# EAGLE design sfm3300 adapter (EAGLE 7.3.0)
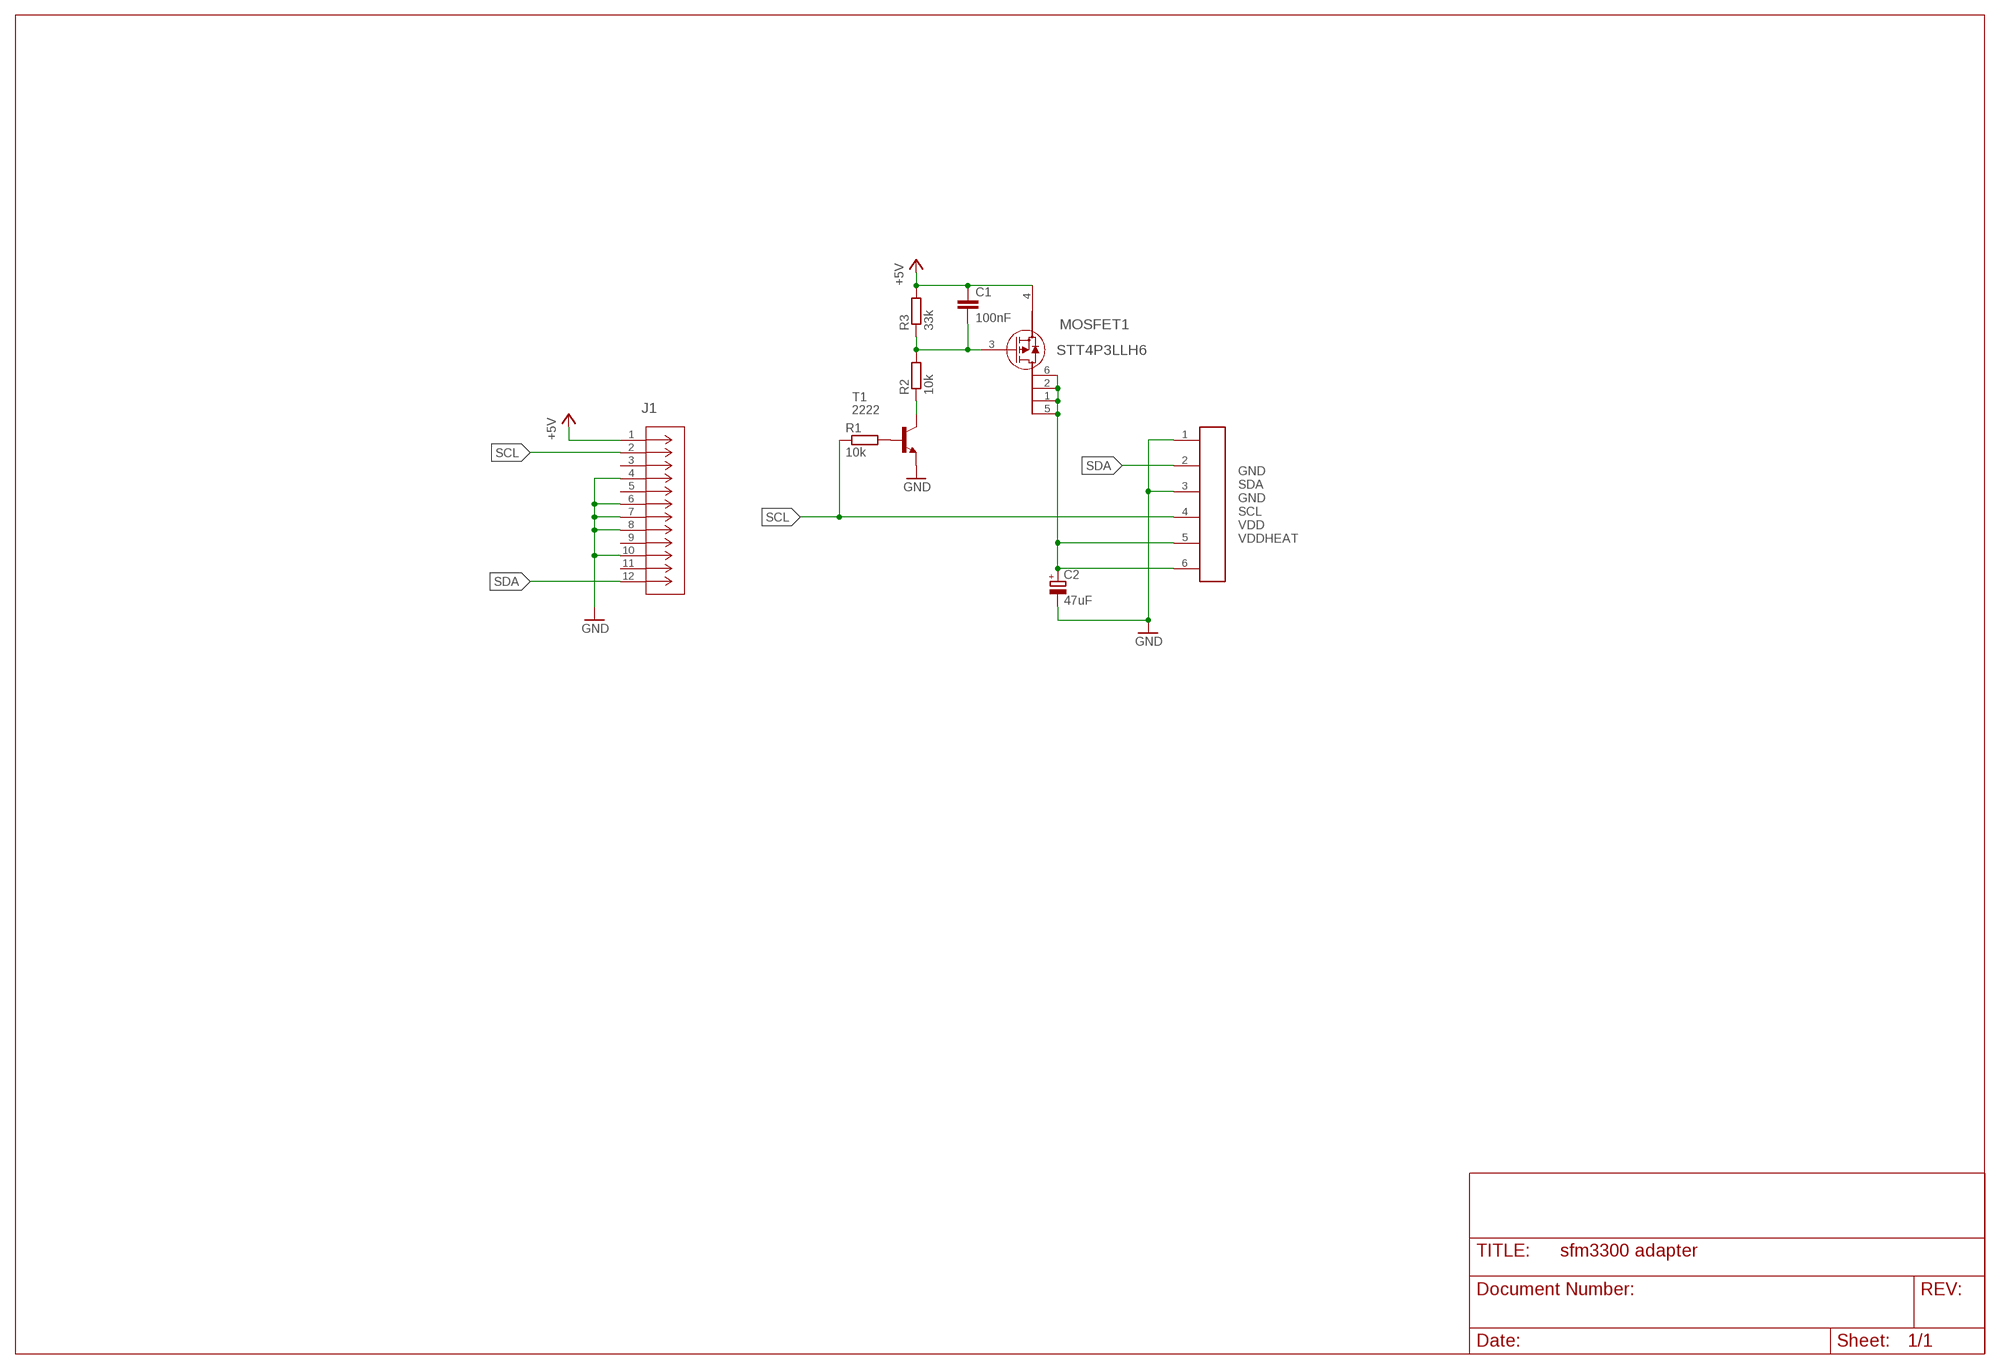
[diagram p0: schematic, sheet 1]

## Parts
C1  100nF  C-EUC0603  [C0603]
C2  47uF  CPOL-EUSMCA  [SMC_A]
J1  1-188275-2  [CONN_1-188275-2_TYC]
MOSFET1  STT4P3LLH6  [SOT23-6L_STM]
R1  10k  R-EU_R0603  [R0603]
R2  10k  R-EU_R0603  [R0603]
R3  33k  R-EU_R0603  [R0603]
T1  2222  MMBT2222ALT1-NPN-SOT23-BEC  [SOT23-BEC]
U$1  SPRING6  [SPRING-6]

## Nets
+5V: C1.1 J1.1 MOSFET1.4 R3.2
GND: C2.- J1.4 J1.6 J1.7 J1.8 J1.10 T1.E U$1.1 U$1.3
N$1: R1.2 T1.B
N$3: C1.2 MOSFET1.3 R2.2 R3.1
N$4: R2.1 T1.C
N$6: C2.+ MOSFET1.1 MOSFET1.2 MOSFET1.5 MOSFET1.6 U$1.5 U$1.6
SCL: J1.2 R1.1 U$1.4
SDA: J1.12 U$1.2
Unconnected: J1.3 J1.5 J1.9 J1.11

## Notes on the sheet
- GND
  SDA
  GND
  SCL
  VDD
  VDDHEAT

## Library data of the parts
C1 = rcl:C-EU: CAPACITOR, European symbol
C2 = rcl:CPOL-EU: POLARIZED CAPACITOR, European symbol
J1 = MICRO-MATCH SMD FTE 1-188275-2:1-188275-2; BUILT_BY: EMA_UL_Team; COPYRIGHT: Copyright (C) 2016 Accelerated Designs. All rights reserved; MANUFACTURER_PART_NUMBER: 1-188275-2; SOURCELIBRARY: Tyco_2012-06-25; VENDOR: TE Connectivity
MOSFET1 = STT4P3LLH6:STT4P3LLH6; BUILT_BY: EMA_Cory; COPYRIGHT: Copyright (C) 2018 Accelerated Designs. All rights reserved; DATASHEET: https://www.st.com/resource/en/datasheet/stt4p3llh6.pdf; MANUFACTURER_PART_NUMBER: STT4P3LLH6; SOURCELIBRARY: Add_to_database_2020-10-30; VENDOR: STMicroelectronics
R1-R3 = rcl:R-EU_: RESISTOR, European symbol
T1 = transistor-neu-to92:*-NPN-: NPN Transistror
U$1 = springloadedcontact:SPRING6: Headers & Wire Housings STD SPRING-LOADED CONNECTOR Mill-Max 821-22-006-10-004101 - height : 5.99 mm - stroke 1.4mm pin diameter : 0.43

## Net classes
0 default: clearance 0.203 mm

## Board
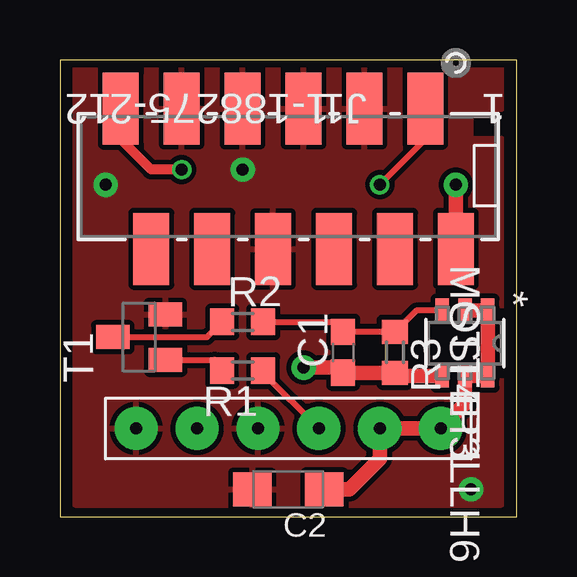
[diagram p1: board, top side]
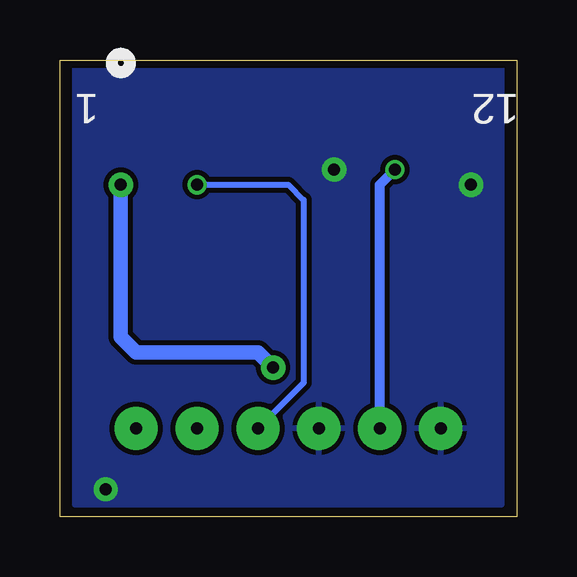
[diagram p2: board, bottom side, seen from below]

Size 19.05 x 19.05 mm. Coordinates in mm from the lower left corner, seen from the top.
Outline: 0,0 19.05,0 19.05,19.05 0,19.05 0,0
Copper layers (1*16): Top 0.035mm / dielectric 1.5mm / Bottom 0.035mm
Design rules "PCB-POOL Standard": minimum track width 0.15mm, minimum drill 0.3mm, track to track 0.15mm, track to pad 0.15mm, pad to pad 0.15mm, via to via 0.15mm, smd to smd 0.15mm, copper to edge 0.3mm, drill to drill 0.2mm, minimum pad ring 0.2mm, minimum via ring 0.15mm, stop-mask expansion 0.075mm, vias tented up to drill 0mil, thermal gap 0.2mm

### Footprints (pad centres in the part's own frame; a part is rotated, then mirrored left to right if it is on the bottom)
C0603 = smd 1.1 x 1: 1 -0.85,0; 2 0.85,0
SMC_A = smd 1.6 x 1.4: + -1.5,0; - 1.5,0
CONN_1-188275-2_TYC = smd 1.499 x 2.997: 1 0,5.85; 2 1.27,0; 3 2.54,5.85; 4 3.81,0; 5 5.08,5.85; 6 6.35,0; 7 7.62,5.85; 8 8.89,0; 9 10.16,5.85; 10 11.43,0; 11 12.7,5.85; 12 13.97,0
SOT23-6L_STM = smd 0.991 x 0.559: 1 -1.359,0.95; 2 -1.359,0; 3 -1.359,-0.95; 4 1.359,-0.95; 5 1.359,0; 6 1.359,0.95
R0603 = smd 1 x 1.1: 1 -0.85,0; 2 0.85,0
SOT23-BEC = smd 1 x 1.4: B -0.95,-1.1; C 0,1.1; E 0.95,-1.1
SPRING-6 = drill 0.5 pad 1.8: 1 -10.16,2.54; 2 -7.62,2.54; 3 -5.08,2.54; 4 -2.54,2.54; 5 0,2.54; 6 2.54,2.54

### Placement (x,y rotation side)
C1  11.81,6.86 90 top
C2  9.53,1.14 180 top
J1  16.51,17.02 180 top
MOSFET1  16.89,7.24 270 top
R1  7.62,6.1 180 top
R2  7.62,8.13 0 top
R3  13.97,6.86 270 top
T1  3.3,7.49 90 top
U$1  13.34,1.14 0 top

### Tracks (layer width: path | path; a pad name or v marks a point on that pad's centre or on a via)
+5V  (via drill 0.5 pad 1.02)
  Top 0.61: MOSFET1.4 14.1,5.88 R3.2 C1.1 11.6,6.22 v10.16,6.22 | J1.1 v16.51,13.84
  Bottom 0.61: v16.51,13.84 16.51,7.49 15.88,6.86 10.79,6.86 v10.16,6.22
GND  (via drill 0.5 pad 1.02)
  other vias: 1.9,13.84 7.62,14.48 17.14,1.14
  pour Top: 0.64,18.92 0.64,0.51 18.41,0.51 18.41,15.75 17.14,15.75 17.14,17.02 18.41,17.02 18.41,18.92
  pour Bottom: 0.64,18.92 0.64,0.51 18.41,0.51 18.41,18.92
N$1
  Top 0.254: T1.B 6.45,6.54 R1.2
N$3
  Top 0.254: MOSFET1.3 14.86,8.6 R3.1 C1.2 11.39,8.13 R2.2
N$4
  Top 0.254: T1.C 6.13,7.49 R2.1
N$6
  Top 0.61: MOSFET1.2 MOSFET1.1 MOSFET1.6 MOSFET1.5 16.89,4.7 U$1.6 U$1.5 13.34,2.41 12.07,1.14 C2.+
SCL  (via drill 0.5)
  Top 0.254: R1.1 8.47,6.01 U$1.4 | J1.2 15.24,15.75 v13.34,13.84
  Bottom 0.254: v13.34,13.84 9.53,13.84 8.89,13.21 8.89,5.59 U$1.4
SDA  (via drill 0.5)
  Top 0.406: v5.08,14.48 3.81,14.48 2.54,15.75 J1.12
  Bottom 0.406: U$1.2 5.71,13.84 v5.08,14.48

### Text on the board
Document: GND | SDA | GND | SCL | VDD | VDD2